# EAGLE design Raspi_Feather_v2 (EAGLE 9.7.0)
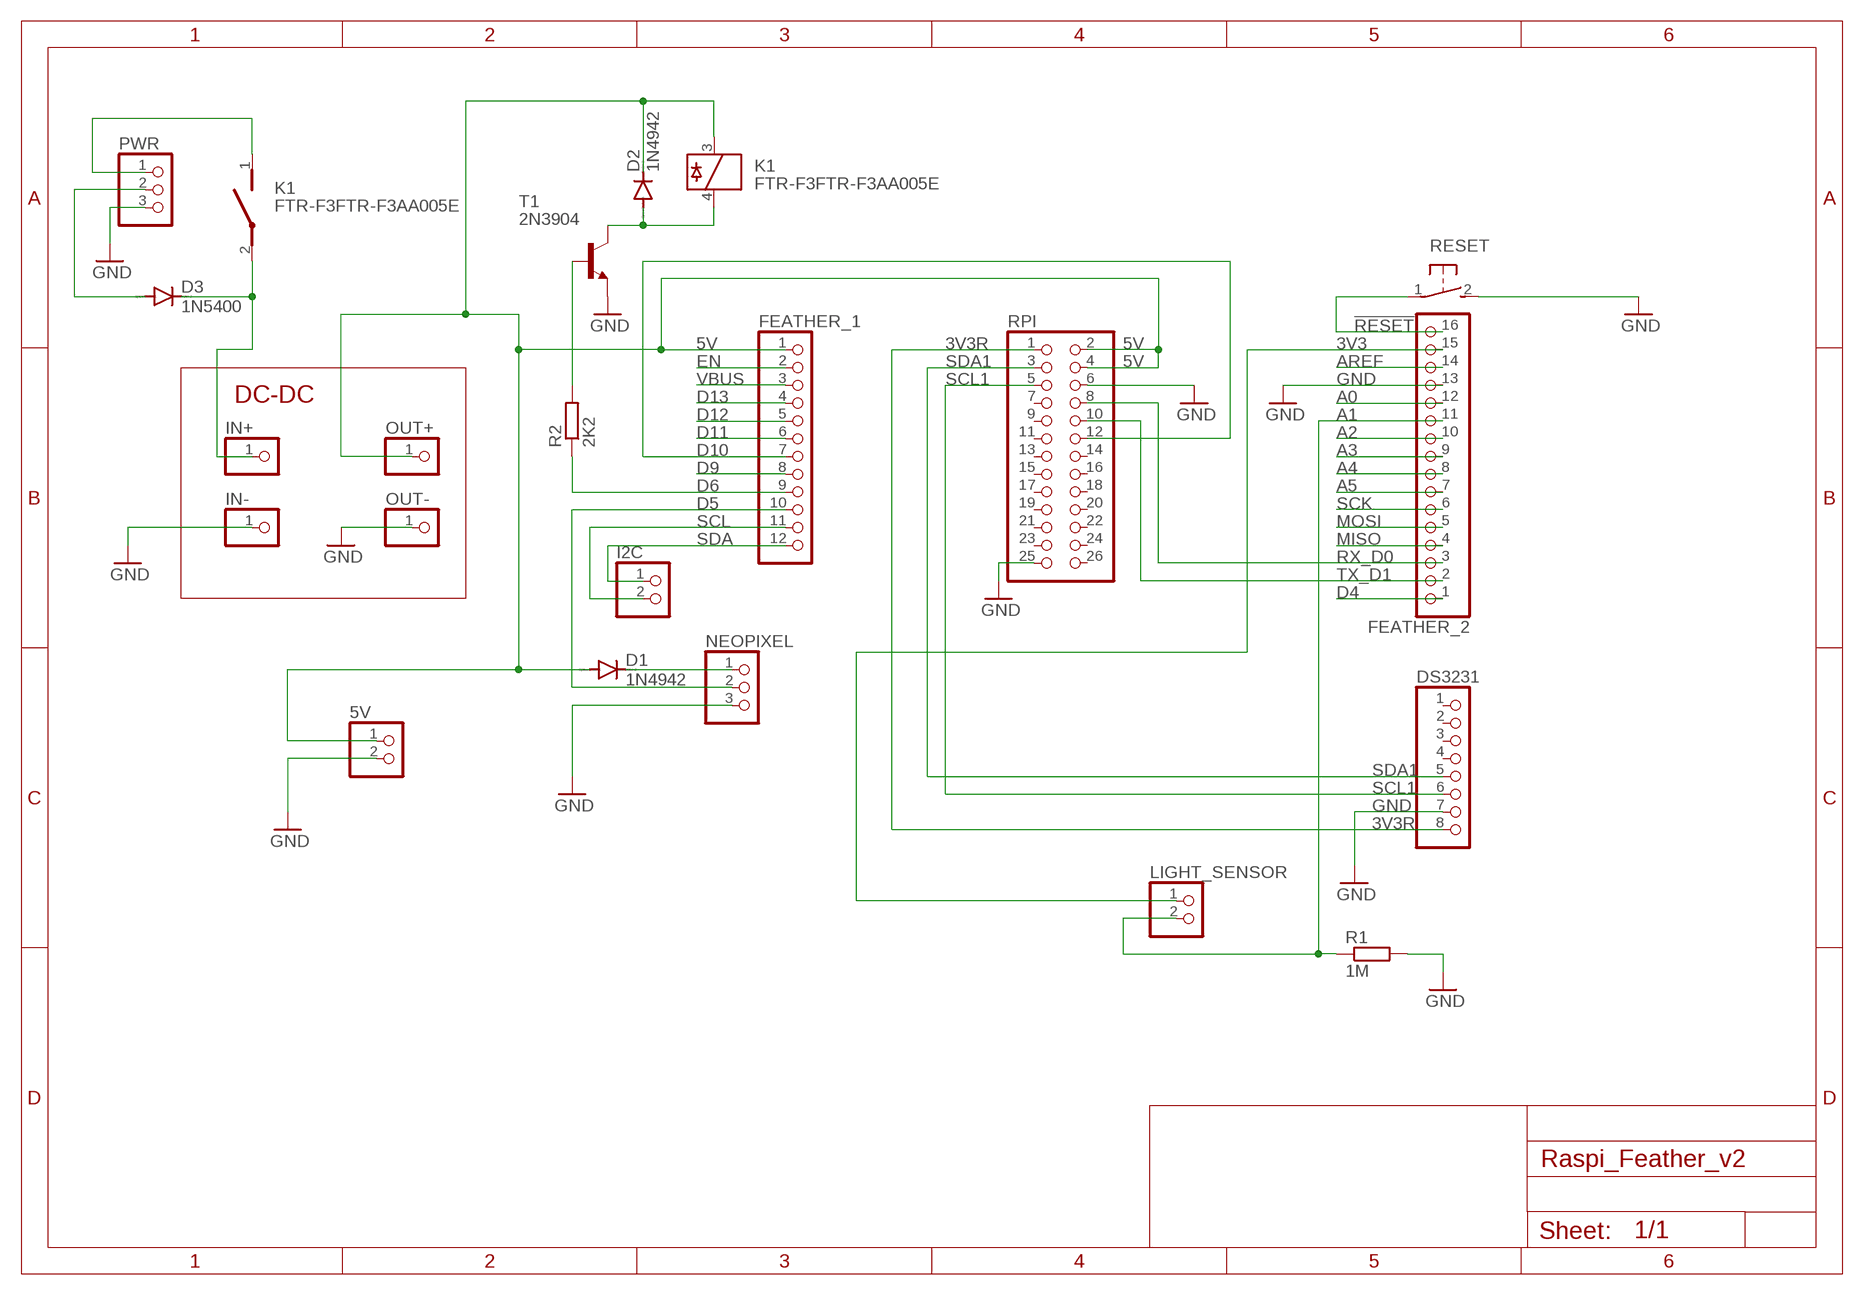
[diagram p0: schematic, sheet 1]

## Parts
5V  PINHD-1X2  [1X02]
D1  1N4942  [DO41-10]
D2  1N4942  [DO41-10]
D3  1N5400  [DO201-15]
DS3231  PINHD-1X8  [1X08]
FEATHER_1  HEADER-1X12  [1X12_ROUND]
FEATHER_2  HEADER-1X16ROUND  [1X16_ROUND]
I2C  PINHD-1X2  [1X02]
IN+  PINHD-1X1  [1X01]
IN-  PINHD-1X1  [1X01]
K1  FTR-F3FTR-F3AA005E  [REED]
LIGHT_SENSOR  PINHD-1X2  [1X02]
NEOPIXEL  PINHD-1X3  [1X03]
OUT+  PINHD-1X1  [1X01]
OUT-  PINHD-1X1  [1X01]
PWR  PINHD-1X3  [1X03]
R1  1M  R-EU_0207/7  [0207/7]
R2  2K2  R-EU_0207/10  [0207/10]
RESET  31-XX  [B3F-31XX]
RPI  PINHD-2X13  [2X13]
T1  2N3904  [TO92]

## Nets
3V3 [power]: FEATHER_2.15 LIGHT_SENSOR.1
3V3R: DS3231.8 RPI.1
5V [power]: 5V.1 D1.A D2.C FEATHER_1.1 K1.3 OUT+.1 RPI.2 RPI.4
!RESET: FEATHER_2.16 RESET.1(P)
A0: FEATHER_2.12
A1: FEATHER_2.11 LIGHT_SENSOR.2 R1.1
A2: FEATHER_2.10
A3: FEATHER_2.9
A4: FEATHER_2.8
A5: FEATHER_2.7
AREF: FEATHER_2.14
D4: FEATHER_2.1
D5: FEATHER_1.10 NEOPIXEL.2
D6: FEATHER_1.9 R2.1
D9: FEATHER_1.8
D10: FEATHER_1.7 RPI.12
D11: FEATHER_1.6
D12: FEATHER_1.5
D13: FEATHER_1.4
EN: FEATHER_1.2
GND [power]: 5V.2 DS3231.7 FEATHER_2.13 IN-.1 NEOPIXEL.3 OUT-.1 PWR.3 R1.2 RESET.2(S) RPI.6 RPI.25 T1.3(E)
IN+ [High_current]: D3.C IN+.1 K1.2
IN_CO [High_current]: K1.1 PWR.1
IN_SW: D3.A PWR.2
MISO: FEATHER_2.4
MOSI: FEATHER_2.5
N$1: D1.C NEOPIXEL.1
N$2: R2.2 T1.2(B)
N$3: D2.A K1.4 T1.1(C)
RX_D0: FEATHER_2.3 RPI.8
SCK: FEATHER_2.6
SCL: FEATHER_1.11 I2C.2
SCL1: DS3231.6 RPI.5
SDA: FEATHER_1.12 I2C.1
SDA1: DS3231.5 RPI.3
TX_D1: FEATHER_2.2 RPI.10
VBUS [power]: FEATHER_1.3
Unconnected: DS3231.1 DS3231.2 DS3231.3 DS3231.4 RPI.7 RPI.9 RPI.11 RPI.13 RPI.14 RPI.15 RPI.16 RPI.17 RPI.18 RPI.19 RPI.20 RPI.21 RPI.22 RPI.23 RPI.24 RPI.26

## Notes on the sheet
- DC-DC

## Library data of the parts
5V I2C LIGHT_SENSOR = pinhead:PINHD-1X2: PIN HEADER
D1 D2 = diode:1N4942: DIODE 1.0 A, 200 V, 150 ns
D3 = diode:1N5400: DIODE standard rectifier, 3 A, 50 V (Motorola)
DS3231 = pinhead:PINHD-1X8: PIN HEADER
FEATHER_1 = microbuilder:HEADER-1X12
FEATHER_2 = microbuilder:HEADER-1X16: PIN HEADER
IN+ IN- OUT+ OUT- = pinhead:PINHD-1X1: PIN HEADER
K1 = fujitsu-ftr-f3:FTR-F3: RELAY For FTR-F3 series: FTR-F3AA005E FTR-F3AA006E FTR-F3AA009E FTR-F3AA012E FTR-F3AA018E FTR-F3AA024E Datasheet: http://www.mouser.com/ds/2/164/ftr-f3-15044.pdf.; MOUSER: 817-FTR-F3AA005E
NEOPIXEL PWR = pinhead:PINHD-1X3: PIN HEADER
R1 R2 = rcl:R-EU_: RESISTOR, European symbol; SPICEPREFIX: R
RESET = switch-omron:31-XX: OMRON SWITCH; MPN: B3F-3100; OC_FARNELL: 959704; OC_NEWARK: 36M3582
RPI = pinhead:PINHD-2X13: PIN HEADER
T1 = transistor:2N3904: NPN TRANSISTOR

## Net classes
0 default: width 0.305 mm, clearance 0.254 mm
1 power: width 0.305 mm, clearance 0.254 mm
2 High_current: width 0.305 mm, clearance 0.254 mm

## Board
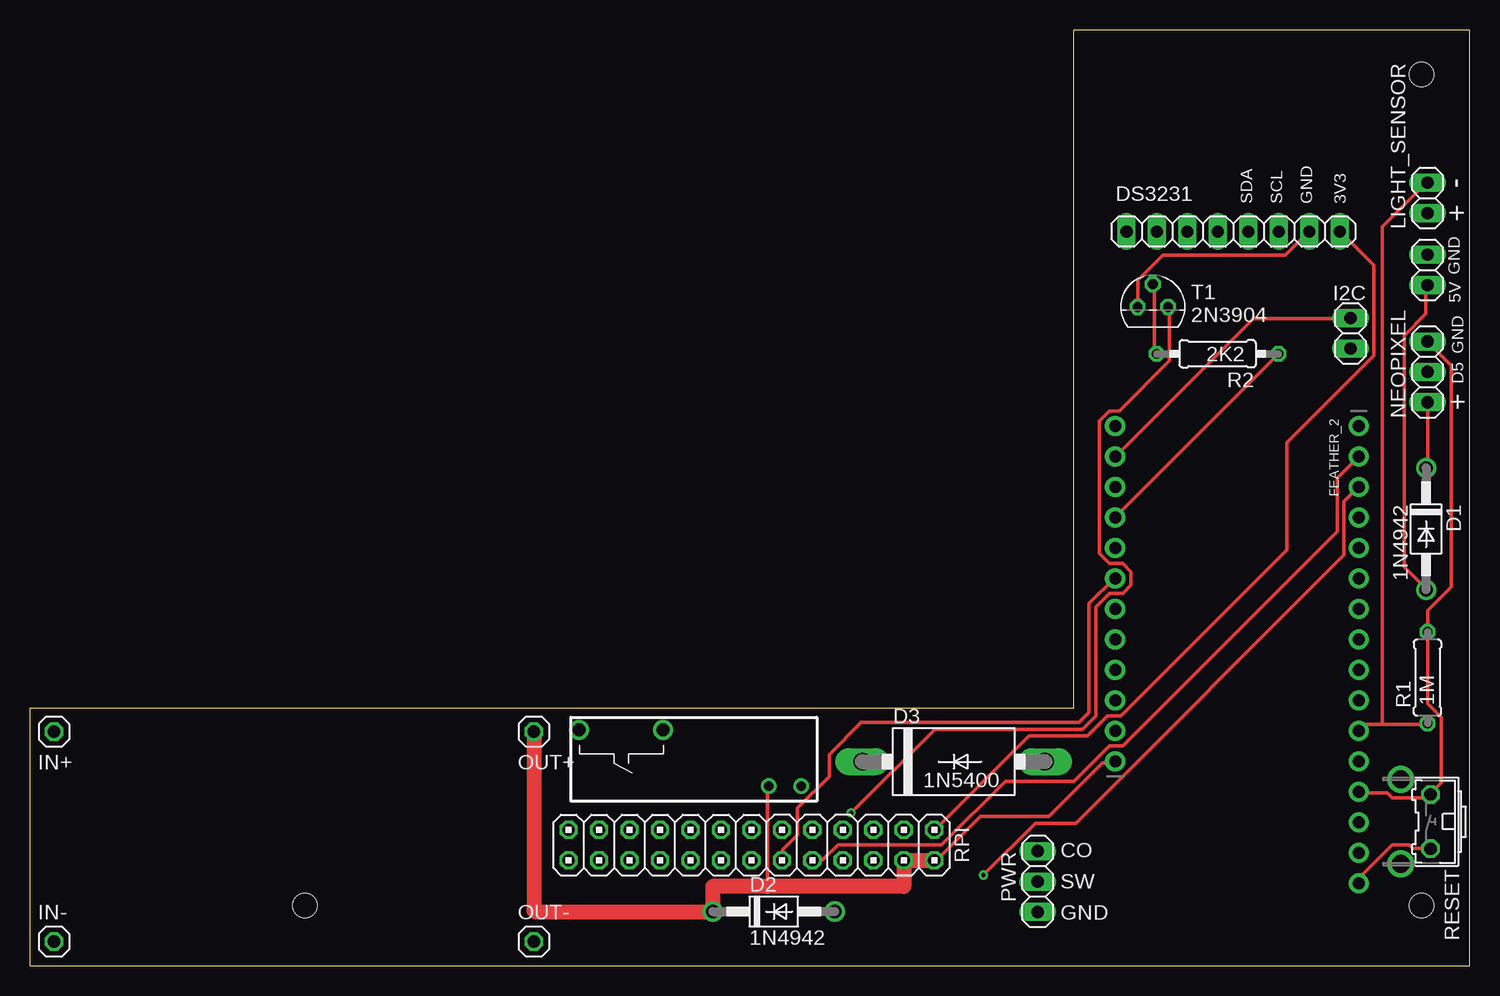
[diagram p1: board, top side]
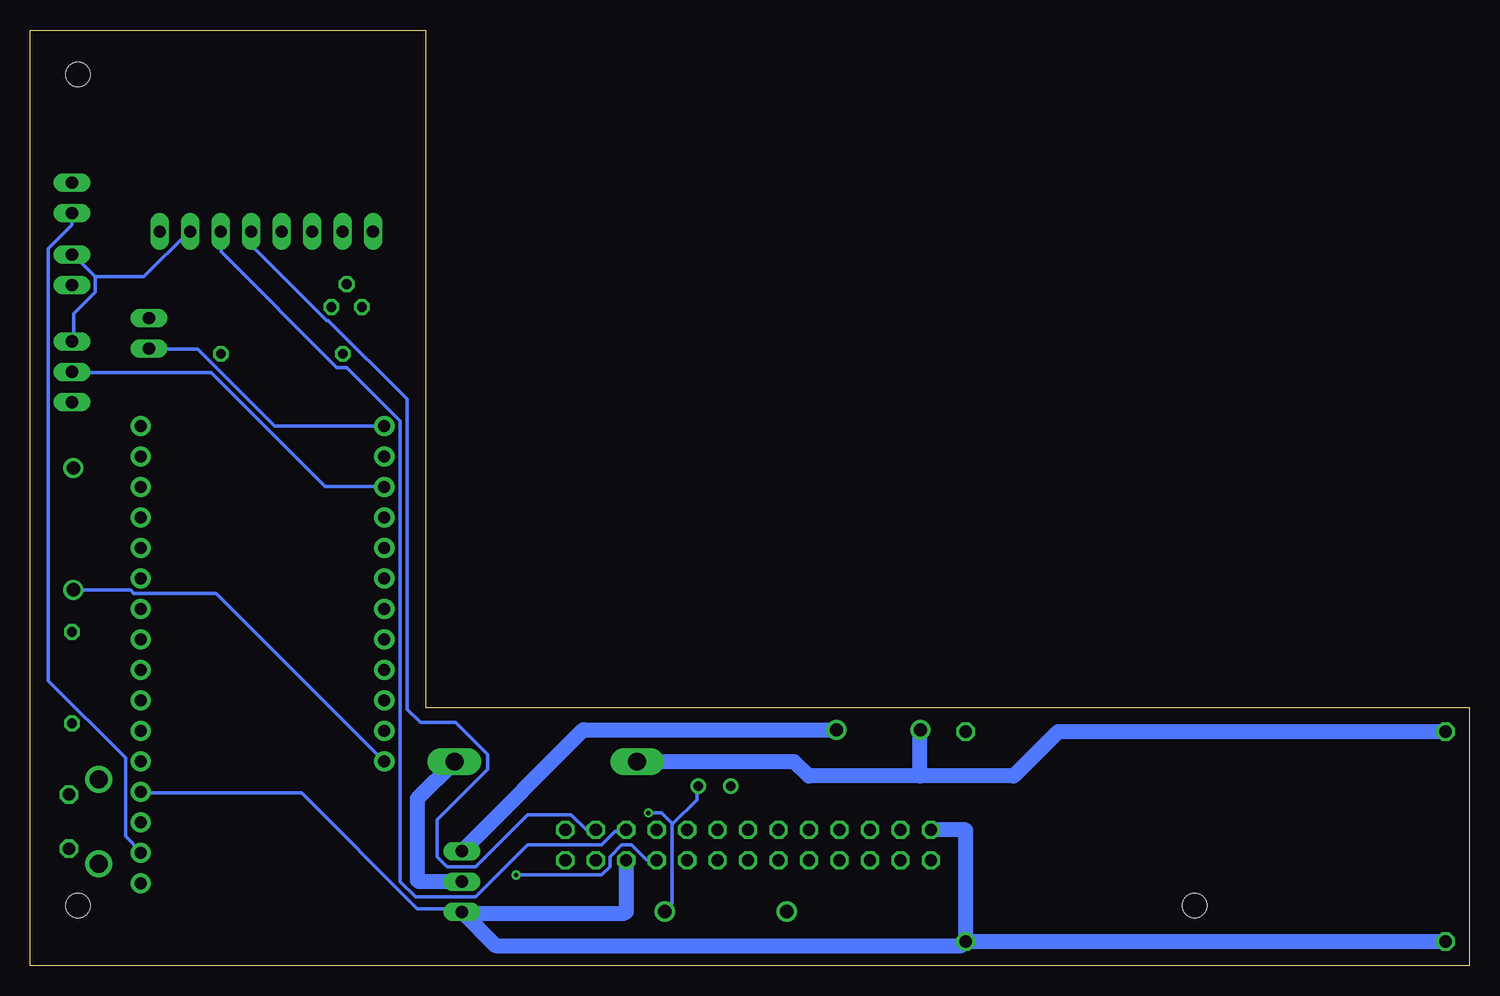
[diagram p2: board, bottom side, seen from below]

Size 120 x 78 mm. Coordinates in mm from the lower left corner, seen from the top.
Outline: 0,0 120,0 120,78 87,78 87,21.5 0,21.5 0,0
Copper layers (1*16): Top / Bottom
Stack-up Default Layer Stack: Top User Defined 0.035mm / Dielectric-1 User Defined 1.5mm / Bottom User Defined 0.035mm
Design rules "default": minimum track width 6mil, minimum drill 0.35mm, track to track 6mil, track to pad 6mil, pad to pad 6mil, via to via 6mil, smd to smd 6mil, copper to edge 40mil, drill to drill 6mil, minimum pad ring 10mil, minimum via ring 8mil, stop-mask expansion 4mil, vias tented up to drill 0mil, thermal gap 10mil
Holes 2 mm at 22.92,5 116,74.3 116,5

### Footprints (pad centres in the part's own frame; a part is rotated, then mirrored left to right if it is on the bottom)
1X02 = drill 1.016 long: 1 -1.27,0; 2 1.27,0
DO41-10 = drill 1.118: A 5.08,0; C -5.08,0
DO201-15 = drill 1.499 long: A 7.62,0; C -7.62,0
1X08 = drill 1.016 long: 1 -8.89,0; 2 -6.35,0; 3 -3.81,0; 4 -1.27,0; 5 1.27,0; 6 3.81,0; 7 6.35,0; 8 8.89,0
1X12_ROUND = drill 1 pad 1.676: 1 -13.97,0; 2 -11.43,0; 3 -8.89,0; 4 -6.35,0; 5 -3.81,0; 6 -1.27,0; 7 1.27,0; 8 3.81,0; 9 6.35,0; 10 8.89,0; 11 11.43,0; 12 13.97,0
1X16_ROUND = drill 1 pad 1.676: 1 -19.05,0; 2 -16.51,0; 3 -13.97,0; 4 -11.43,0; 5 -8.89,0; 6 -6.35,0; 7 -3.81,0; 8 -1.27,0; 9 1.27,0; 10 3.81,0; 11 6.35,0; 12 8.89,0; 13 11.43,0; 14 13.97,0; 15 16.51,0; 16 19.05,0
1X01 = drill 1.016 octagon: 1 0,0
REED = drill 1.1: 1 12.82,1.05; 2 19.82,1.05 | drill 0.8: 3 4.02,5.75; 4 1.32,5.75
1X03 = drill 1.016 long: 1 -2.54,0; 2 0,0; 3 2.54,0
0207/7 = drill 0.813 octagon: 1 -3.81,0; 2 3.81,0
0207/10 = drill 0.813 octagon: 1 -5.08,0; 2 5.08,0
B3F-31XX = drill 1.016 octagon: 1 -2.261,-1.245; 2 2.261,-1.245 | drill 1.499 pad 2.159: 3 -3.505,1.245; 4 3.505,1.245
2X13 = drill 1.016 octagon: 1 -15.24,-1.27; 2 -15.24,1.27; 3 -12.7,-1.27; 4 -12.7,1.27; 5 -10.16,-1.27; 6 -10.16,1.27; 7 -7.62,-1.27; 8 -7.62,1.27; 9 -5.08,-1.27; 10 -5.08,1.27; 11 -2.54,-1.27; 12 -2.54,1.27; 13 0,-1.27; 14 0,1.27; 15 2.54,-1.27; 16 2.54,1.27; 17 5.08,-1.27; 18 5.08,1.27; 19 7.62,-1.27; 20 7.62,1.27; 21 10.16,-1.27; 22 10.16,1.27; 23 12.7,-1.27; 24 12.7,1.27; 25 15.24,-1.27; 26 15.24,1.27
TO92 = drill 0.813 octagon: 1 1.27,0; 2 0,1.905; 3 -1.27,0

### Placement (x,y rotation side)
5V  116.5,58 90 top
D1  116.38,36.4 270 top
D2  62,4.5 0 top
D3  77,17 0 top
DS3231  100.3,61.2 0 top
FEATHER_1  90.46,31 90 top
FEATHER_2  110.78,25.92 270 top
I2C  110.08,52.71 90 top
IN+  2,19.5 0 top
IN-  2,2 0 top
K1  65.6,20.7 180 top
LIGHT_SENSOR  116.5,64 90 top
NEOPIXEL  116.5,49.5 90 top
OUT+  42,19.5 0 top
OUT-  42,2 0 top
PWR  84,7 270 top
R1  116.5,24 90 top
R2  99,51 180 top
RESET  115.5,12 90 top
RPI  60.14,10.04 180 top
T1  93.6,54.9 0 top

### Tracks (layer width: path | path; a pad name or v marks a point on that pad's centre or on a via)
3V3
  Bottom 0.305: LIGHT_SENSOR.1 116.51,61.75 118.47,59.79 118.47,23.75 112.04,17.32 112.04,10.76 110.78,9.5 FEATHER_2.15
3V3R
  Top 0.305: RPI.1 75.44,11.32 83.26,19.14 88.15,19.14 89.83,20.82 90.94,20.82 104.78,34.65 104.78,43.59 112.04,50.85 112.04,58.4 109.25,61.19 DS3231.8
5V
  Top 0.305: 5V.1 116.37,56.72 116.37,54.34 114.55,52.53 114.55,33.25 116.37,31.43 D1.A | 61.47,6.6 61.47,14.95 K1.3 | FEATHER_1.1 90.39,16.9 89.41,16.9 84.94,12.43 79.21,12.43 75.86,9.08 RPI.2
  Top 1.27: OUT+.1 42,4.6 42.1,4.5 D2.C 56.9,4.52 56.9,6.6 61.47,6.6 72.84,6.6 RPI.4 RPI.2
  Bottom 0.305: D1.A 116.37,31.29 111.62,31.29 111.34,31.01 104.5,31.01 90.53,17.04 FEATHER_1.1
!RESET
  Top 0.305: RESET.1 116.65,9.78 115.25,9.78 114.97,10.06 113.58,10.06 110.78,7.26 110.78,6.99 FEATHER_2.16
A1
  Top 0.305: 112.74,20.12 111.2,20.12 110.78,19.7 FEATHER_2.11 | 112.74,20.12 116.37,20.12 R1.1 | 112.74,20.12 112.74,61.61 116.37,65.24 LIGHT_SENSOR.2
D5
  Bottom 0.305: NEOPIXEL.2 116.37,49.45 104.92,49.45 95.42,39.95 90.53,39.95 FEATHER_1.10
D6
  Top 0.152: 90.45,37.41 FEATHER_1.9
  Top 0.305: R2.1 90.53,37.44 FEATHER_1.9
D10
  Top 0.305: RPI.12 62.73,8.8 62.73,9.64 63.98,10.9 63.98,13.13 66.64,15.79 66.64,17.6 69.29,20.26 87.45,20.26 88.29,21.09 88.29,30.18 90.39,32.27 FEATHER_1.7
GND
  Top 0.305: FEATHER_2.13 110.78,14.39 113.16,14.39 113.58,13.97 116.37,13.97 116.65,14.25 RESET.2 116.79,14.39 117.63,15.23 117.63,20.68 116.51,21.79 R1.2 116.51,27.94 116.51,29.62 118.47,31.57 118.47,50.01 116.51,51.97 NEOPIXEL.3 | T1.3 92.34,54.9 92.34,57.14 94.44,59.23 104.64,59.23 106.59,61.19 DS3231.7
  Bottom 0.305: 114.55,57.42 114.55,56.16 116.37,54.34 116.37,52.11 NEOPIXEL.3 | 114.55,57.42 116.37,59.23 5V.2 | 114.55,57.42 110.5,57.42 106.73,61.19 DS3231.7 | FEATHER_2.13 110.64,14.39 97.37,14.39 87.73,4.75 84.52,4.75 PWR.3
  Bottom 1.27: IN-.1 OUT-.1 | OUT-.1 42.35,1.65 81.19,1.65 PWR.3 83.9,4.36 70.41,4.36 70.3,4.47 RPI.6 | OUT-.1 42,11.3 42.01,11.31 RPI.25
IN+
  Bottom 1.27: IN+.1 34.3,19.5 38,15.8 45.8,15.8 | 45.8,15.8 45.8,19.63 K1.2 | 45.8,15.8 55.1,15.8 56.3,17 D3.C
IN_CO
  Bottom 1.27: PWR.1 73.89,19.65 K1.1
IN_SW
  Bottom 1.27: PWR.2 87.6,7 87.7,7.1 87.7,13.92 D3.A
N$1
  Top 0.305: NEOPIXEL.1 116.51,46.94 116.51,41.49 D1.C
N$2
  Top 0.305: T1.2 93.74,56.72 93.74,51.27 93.88,51.13 R2.2
N$3  (via drill 0.35)
  Top 0.305: v68.45,12.71 75.44,19.7 87.73,19.7 88.85,20.82 88.85,29.9 89.97,31.01 91.08,31.01 91.78,31.71 91.78,32.83 91.08,33.53 89.97,33.53 89.13,34.37 89.13,45.4 89.97,46.24 90.81,46.24 95,50.43 95,54.76 T1.1
  Bottom 0.305: 66.43,11.8 66.5,11.73 66.5,5.17 67.06,4.61 D2.A | 66.43,11.8 64.4,13.83 64.4,14.95 K1.4 | v68.45,12.71 67.33,12.71 66.43,11.8
RX_D0  (via drill 0.35)
  Top 0.305: v79.49,7.54 83.82,11.87 87.17,11.87 109.53,34.23 109.53,38.7 110.64,39.81 FEATHER_2.3
  Bottom 0.305: v79.49,7.54 72.36,7.54 71.67,8.24 71.67,9.08 70.69,10.06 69.85,10.06 68.59,8.8 67.89,8.8 RPI.8
SCL
  Top 0.305: I2C.2 109.94,53.92 101.98,53.92 90.53,42.47 FEATHER_1.11
SCL1
  Bottom 0.305: RPI.5 70.41,11.18 71.25,11.18 72.36,10.06 78.51,10.06 82.84,5.73 87.87,5.73 89.13,6.99 89.13,45.4 93.6,49.87 94.44,49.87 104.08,59.51 104.08,61.19 DS3231.6
SDA
  Bottom 0.305: I2C.1 109.94,51.41 106.03,51.41 99.61,44.98 90.53,44.98 FEATHER_1.12
SDA1
  Bottom 0.305: RPI.3 72.92,11.32 73.62,11.32 74.88,12.57 78.51,12.57 82.84,8.24 85.22,8.24 86.06,9.08 86.06,12.15 81.86,16.34 81.86,17.6 84.52,20.26 87.45,20.26 88.57,21.37 88.57,47.22 95.14,53.78 95.28,53.78 101.56,60.07 DS3231.5
TX_D1
  Top 0.305: RPI.10 65.24,8.8 66.08,8.8 67.33,10.06 76,10.06 81.31,15.37 87.03,15.37 89.97,18.3 91.08,18.3 108.97,36.18 108.97,40.65 110.64,42.33 FEATHER_2.2

### Text on the board
tNames: - | SDA | SCL | GND | 3V3 | + | GND | GND | D5 | + | CO | SW | GND